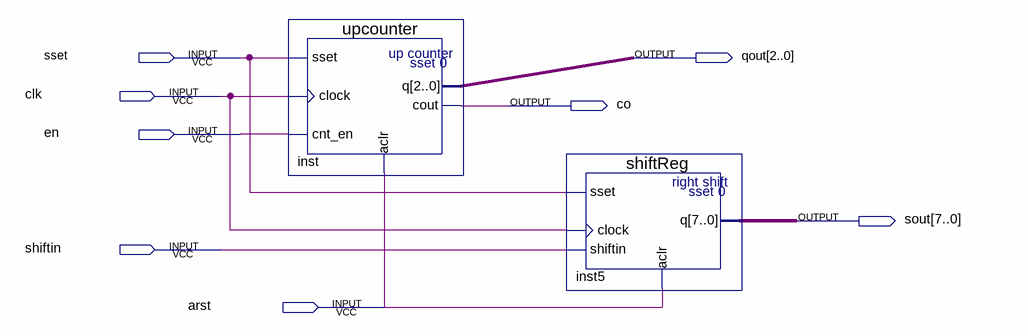
[diagram p0: schematic sheet]
// Quartus schematic upcounter.bdf as structural Verilog: 2 symbols, 8 pins
module upcounter (
  input  sset,
  input  clk,
  input  en,
  input  shiftin,
  input  arst,
  output [2:0] qout,
  output co,
  output [7:0] sout
);

  upcounter inst (.sset(sset), .clock(clk), .cnt_en(en), .aclr(arst), .cout(co), .q(qout));
  shiftReg inst5 (.sset(sset), .clock(clk), .shiftin(shiftin), .aclr(arst), .q(sout));
endmodule
